# Altium schematic sheet business card.SchDoc: PCB Business Card
size A; Author: Alexander Cafarella
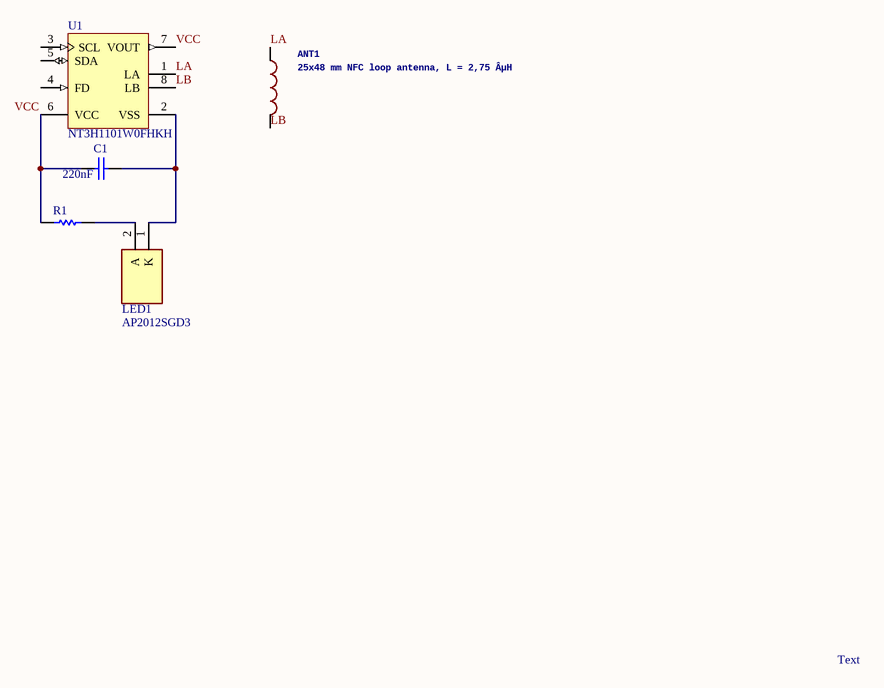
[diagram p0: business card.SchDoc]

## Parts
ANT1  25x48 mm NFC loop antenna, L = 2,75 ÂµH  [25X48MM_NFC_ANTENNA]
C1  value 220nF  [CAPC1608X90X35ML10T15]  (hidden comment: GRM188R70J224KA88D)
LED1  AP2012SGD3  [LEDC2012X110N]
R1  ERJ-6ENF4700V  [RESC2013X70X40ML20T20]  (value not drawn)
U1  NT3H1101W0FHKH  [NXP-SOT902-3_V]

## Nets
LA: ANT1.P$1 U1.1(LA)
LB: ANT1.P$2 U1.8(LB)
VCC: C1.1 R1.1 U1.6(VCC) U1.7(VOUT)
NetC1_2: C1.2 LED1.1(K) U1.2(VSS)
NetLED1_2: LED1.2(A) R1.2

Not connected (* = marked no-connect by the designer): U1 3(SCL) 4(FD) 5(SDA)

## Notes on the sheet
- Text
- Title
- Size:
- Date:
- A
- Number:
- Time:
- Revision:
- Sheet
- of
- File:

## Library data of the parts
ANT1 = 25X48MM_NFC_ANTENNA: GateName_1: G$1; SymbolName_1: ANTENNA; LibraryName: PCB_BusinessCard; DeviceSetName: 25X48MM_NFC_ANTENNA; Package: 25X48MM_NFC_ANTENNA
C1 = CMP-2006-02828-1: Manufacturer: Murata; Part Number: GRM188R70J224KA88D
LED1 = AP2012SGD3: LED; Manufacturer_Name: Kingbright; Datasheet Link: https://componentsearchengine.com/Datasheets/1/AP2012SGD3.pdf; Height: 1.1mm; Mouser2 Part Number: 604-AP2012SGD3; Mouser2 Price/Stock: https://www.mouser.com/Search/Refine.aspx?Keyword=604-AP2012SGD3; Manufacturer_Part_Number: AP2012SGD3
R1 = CMP-1665-00004-3: Chip Resistor, 470 Ohm, +/- 1%, 0.125 W, -55 to 155 degC, 0805 (2012 Metric), RoHS, Tape and Reel; Voltage Rating: 150 V; Value: 47R; Package Quantity: 1; Length: 2 mm; DatasheetVersion: 04/2015; Mounting Technology: Surface Mount; PackageReference: 0805; RoHSCompliant: true; Packaging: Cut Tape; Max Operating Temperature: 155 degC; Min Operating Temperature: -55 degC; Height: 0.6 mm; REACH SVHC: Yes; Mount: Surface Mount; PackageDescription: 2-Pin Surface Mount Device, Body 2 x 1.25 mm; Pins: 2
U1 = CMP-2000-06861-1: NTAG I2C-Energy Harvesting NFC Forum Type 2 Tag with Field Detection Pin and I2C Interface, 1.7 to 3.6 V, -40 to 95 degC, 8-Pin QFN (SOT-902-3), RoHS, Tape and Reel; Manufacturer: NXP; Brand: NXPSemiconductors; Memory Size: 1kB; Package Version: 02/2016; Operating Frequency: 13.56MHz; Function: NTAGI2CNFCForumType2interface; Manufacturer URL: http://www.nxp.com/; Packaging: Reel; Maximum Operating Temperature: +85C; Factory Pack Quantity: 4000; Package Reference: SOT902-3; Operating Temperature Range: -40Cto+85C; Datasheet URL: http://www.nxp.com/documents/data_sheet/NT3H1101_1201.pdf; Datasheet Version: Rev. 3.3, 07/2015; RoHS: True; Package Description: 8-Pin Quad Flat No-lead Package, Body 1.6 x 1.6 mm, Pitch 0.5 mm; Package / Case: XQFN-8; Minimum Operating Temperature: -40C; Package URL: http://www.nxp.com/documents/outline_drawing/SOT902-3.pdf; Product Category: RFIDTransponders; Mounting Technology: SurfaceMount; Mounting Style: SMD/SMT